# Altium project meltdown_interface.PrjPcb
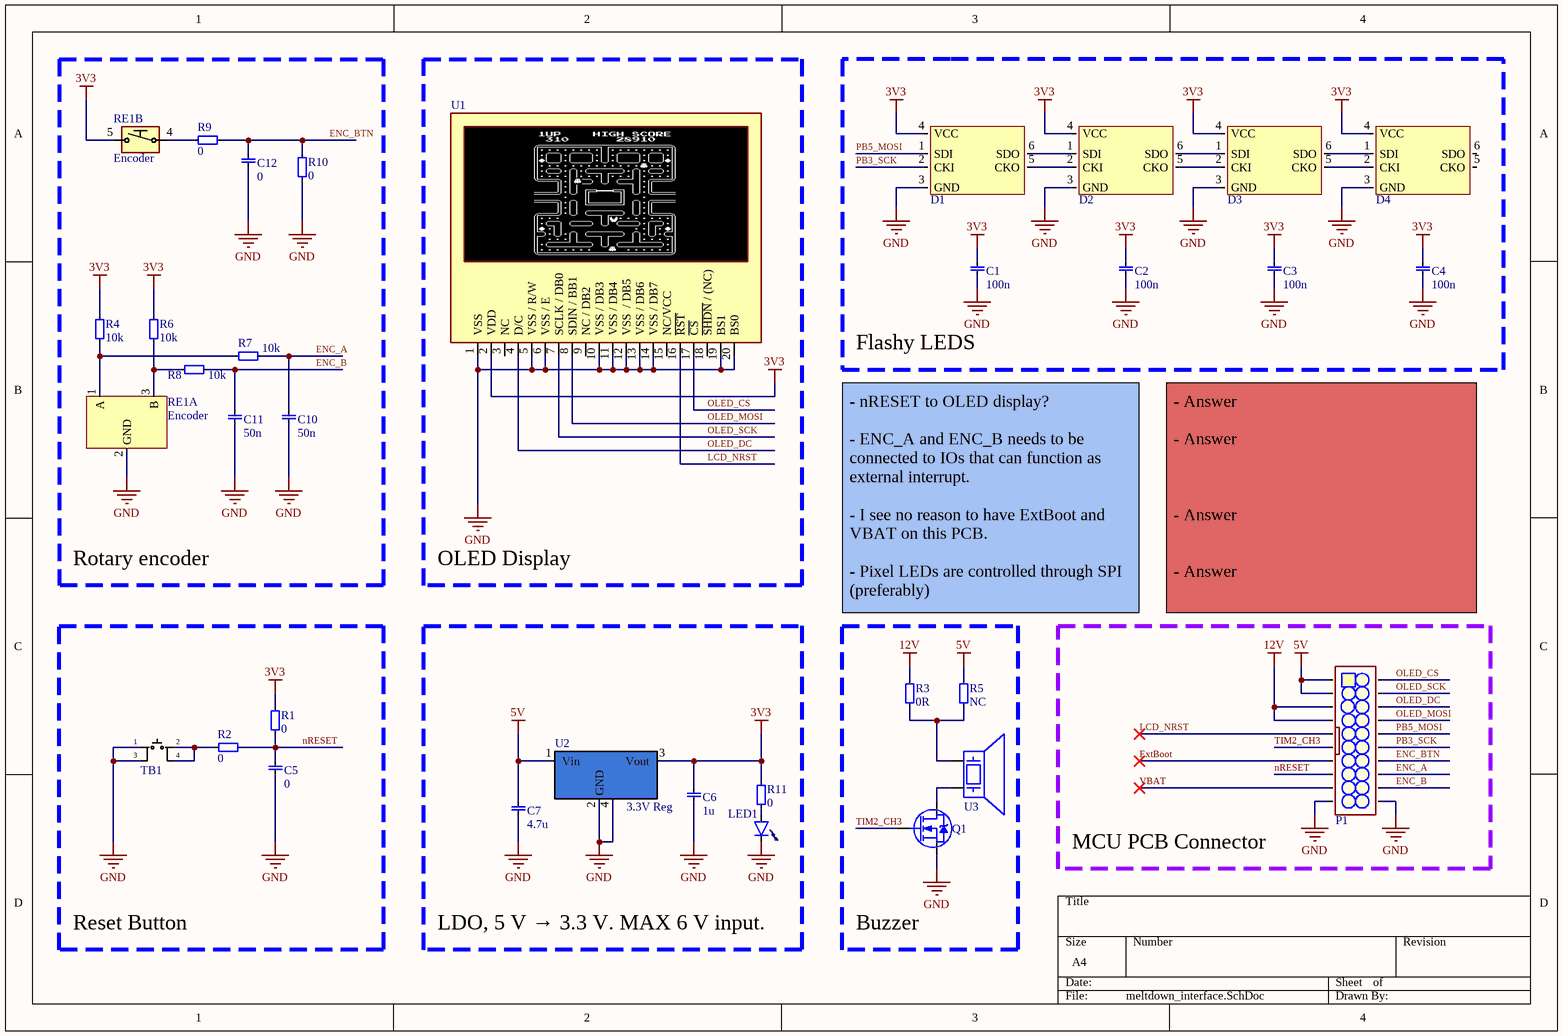
[diagram p0: meltdown_interface.SchDoc]
1 sheet, 33 parts. Net scope: global (net labels, ports and power ports of the same name join across sheets).
Board file: meltdown_interface.PcbDoc

## Sheet meltdown_interface.SchDoc
size A4; SheetNumber: 1; SheetTotal: 1

### Parts
C1  value 100n  [0603 cap]  (hidden comment: 0603, capacitor)
C2  value 100n  [0603 cap]  (hidden comment: 0603, capacitor)
C3  value 100n  [0603 cap]  (hidden comment: 0603, capacitor)
C4  value 100n  [0603 cap]  (hidden comment: 0603, capacitor)
C5  value 0  [0603 cap]  (hidden comment: 0603, capacitor)
C6  value 1u  [0603 cap]  (hidden comment: 0603, capacitor)
C7  value 4.7u  [0603 cap]  (hidden comment: 0603, capacitor)
C10  value 50n  [0603 cap]  (hidden comment: 0603, capacitor)
C11  value 50n  [0603 cap]  (hidden comment: 0603, capacitor)
C12  value 0  [0603 cap]  (hidden comment: 0603, capacitor)
D1  Neo - SK9822  [SK9822]  (value not drawn)
D2  Neo - SK9822  [SK9822]  (value not drawn)
D3  Neo - SK9822  [SK9822]  (value not drawn)
D4  Neo - SK9822  [SK9822]  (value not drawn)
LED1  0805, LED  [0805_led]  (value not drawn)
P1  2x10 Ribbon Header  [2x10_RIBBON_CABLE_CON]  (value not drawn)
Q1  BSS138  [SOT323]  (value not drawn)
R1  value 0  [0603]  (hidden comment: 0603, resistor)
R2  value 0  [0603]  (hidden comment: 0603, resistor)
R3  value 0R  [0603]  (hidden comment: 0603, resistor)
R4  value 10k  [0603]  (hidden comment: 0603, resistor)
R5  value NC  [0603]  (hidden comment: 0603, resistor)
R6  value 10k  [0603]  (hidden comment: 0603, resistor)
R7  value 10k  [0603]  (hidden comment: 0603, resistor)
R8  value 10k  [0603]  (hidden comment: 0603, resistor)
R9  value 0  [0603]  (hidden comment: 0603, resistor)
R10  value 0  [0603]  (hidden comment: 0603, resistor)
R11  value 0  [0603]  (hidden comment: 0603, resistor)
RE1  Encoder  [RotaryEncoder]  (parts A,B of 2)
TB1  Tactile Button  [tacButton smd]  (value not drawn)
U1  NHD-2.7-12864WDW  [NHD-2.7-1286]  (value not drawn)
U2  3.3V Reg  [SOT223]
U3  Piezo element  [Piezo buzzer]  (value not drawn)

### Blocks framed on the sheet
Rotary encoder: C10-C12 R4 R6-R10 RE1
OLED Display: U1
Flashy LEDS: C1-C4 D1-D4
Reset Button: C5 R1 R2 TB1
LDO, 5 V → 3.3 V. MAX 6 V input.: C6 C7 LED1 R11 U2
Buzzer: Q1 R3 R5 U3
MCU PCB Connector: P1

### Nets
3V3: C1.1 C2.1 C3.1 C4.1 C6.1 D1.4(VCC) D2.4(VCC) D3.4(VCC) D4.4(VCC) R1.1 R4.0 R6.0 R11.0 RE1.5(B) U1.2(VDD) U2.3(Vout)
5V: C7.1 P1.1 P1.2 R5.0 U2.1(Vin)
12V: P1.3 P1.4 R3.0
GND: C1.0 C2.0 C3.0 C4.0 C5.0 C6.0 C7.0 C10.0 C11.0 C12.0 D1.3(GND) D2.3(GND) D3.3(GND) D4.3(GND) LED1.0(Cathode) P1.10 P1.11 Q1.3(S) R10.1 RE1.2(GND) TB1.1 TB1.3 U1.1(VSS) U1.5(VSS_/_R/W) U1.6(VSS_/_E) U1.10(VSS_/_DB3) U1.11(VSS_/_DB4) U1.12(VSS__/_DB5) U1.13(VSS_/_DB6) U1.14(VSS_/_DB7) U1.19(BS1) U1.20(BS0) U2.2(GND) U2.4
ENC_A: C10.1 P1.13 R7.0
ENC_B: C11.1 P1.12 R8.0
ENC_BTN: C12.1 P1.14 R9.1 R10.0
ExtBoot: P1.7
LCD_NRST: P1.5 U1.16(~{RST})
nRESET: C5.1 P1.8 R1.0 R2.1
OLED_CS: P1.20 U1.17(~{CS})
OLED_DC: P1.18 U1.4(D/C)
OLED_MOSI: P1.17 U1.8(SDIN_/_BB1)
OLED_SCK: P1.19 U1.7(SCLK_/_DB0)
PB3_SCK: D1.2(CKI) P1.15
PB5_MOSI: D1.1(SDI) P1.16
TIM2_CH3: P1.6 Q1.1(G)
VBAT: P1.9
NetD1_5: D1.5(CKO) D2.2(CKI)
NetD1_6: D1.6(SDO) D2.1(SDI)
NetD2_5: D2.5(CKO) D3.2(CKI)
NetD2_6: D2.6(SDO) D3.1(SDI)
NetD3_5: D3.5(CKO) D4.2(CKI)
NetD3_6: D3.6(SDO) D4.1(SDI)
NetLED1_1: LED1.1 R11.1
NetQ1_2: Q1.2(D) U3.2
NetR2_0: R2.0 TB1.2 TB1.4
NetR3_1: R3.1 R5.1 U3.1
NetR4_1: R4.1 R7.1 RE1.1(A)
NetR6_1: R6.1 R8.1 RE1.3(B)
NetR9_0: R9.0 RE1.4(B)

Not connected (* = marked no-connect by the designer): D4 5(CKO) 6(SDO); U1 3(NC) 9(NC_/_DB2) 15(NC/VCC) 18(~{SHDN}_/_(NC))

### Notes on the sheet
- - nRESET to OLED display?
  - ENC_A and ENC_B needs to be connected to IOs that can function as external interrupt.
  - I see no reason to have ExtBoot and VBAT on this PCB.
  - Pixel LEDs are controlled through SPI (preferably)
- - Answer
  - Answer
  - Answer
  - Answer

### Library data of the parts
D1-D4 = Neo - SK9822: Value: WS2812; DigiKey: 1568-1800-ND
LED1 = 0805, LED: Value: 0805 LED
P1 = 2x10 Ribbon Header: 2.54 mm; Value: 1x10 Pin Header
Q1 = BSS138: N-Channel Logic Level Enhancement Mode Field Effect Transistor
RE1 = Rotary Encoder with Button
TB1 = TacButton SMD: Tactile Switch Small Low; ELFA: 110-87-406; Value: Button SMD
U1 = NHD-2.7-12864WDW: Graphic LCD Display Module White OLED - Passive Matrix Parallel/Serial 2.7" (68.58mm) 128 x 64
U2 = MCP1826S: 500 mA, Positive Fixed-Voltage, Low-Dropout Regulator; Drop Out: 250mV; Value: MCP1826S; Farnell: 1287689
C1-C7 C10-C12 = 0603, capacitor: Order number: *
U3 = Piezo element: Value: Piezo element